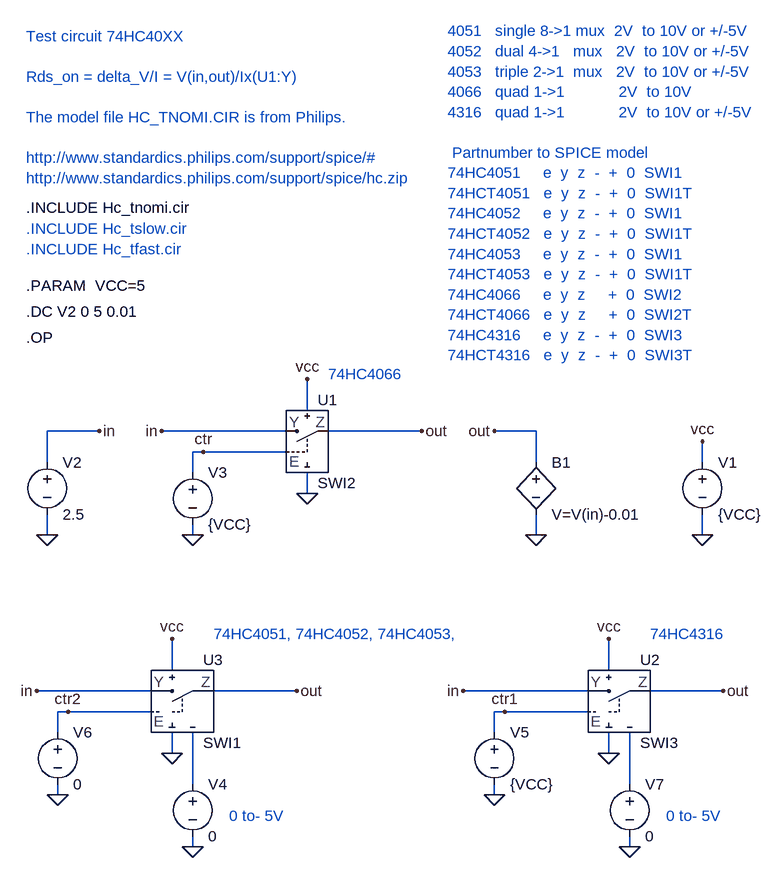
[diagram p0: schematic SWITCH_HC40XX_test.asc]
SWITCH_HC40XX_test.asc, the LTspice schematic file:
Version 4
SHEET 1 2080 1316
WIRE -272 160 -272 112
WIRE -272 272 -272 240
WIRE -256 576 -256 544
WIRE -256 672 -256 656
WIRE -240 544 -256 544
WIRE -192 112 -272 112
WIRE -112 512 -288 512
WIRE -112 544 -240 544
WIRE -80 480 -80 432
WIRE -80 608 -80 576
WIRE -48 176 -48 144
WIRE -48 272 -48 256
WIRE -48 656 -48 576
WIRE -48 752 -48 736
WIRE -32 144 -48 144
WIRE 96 112 -96 112
WIRE 96 144 -32 144
WIRE 112 512 -16 512
WIRE 128 80 128 32
WIRE 128 208 128 176
WIRE 304 112 160 112
WIRE 416 576 416 544
WIRE 416 672 416 656
WIRE 432 544 416 544
WIRE 480 112 416 112
WIRE 480 160 480 112
WIRE 480 272 480 240
WIRE 560 512 368 512
WIRE 560 544 432 544
WIRE 592 480 592 432
WIRE 592 608 592 576
WIRE 624 656 624 576
WIRE 624 752 624 736
WIRE 736 160 736 128
WIRE 736 272 736 240
WIRE 768 512 656 512
FLAG 736 272 0
FLAG -272 272 0
FLAG -48 272 0
FLAG 128 208 0
FLAG 480 272 0
FLAG -96 112 in
FLAG 304 112 out
FLAG 128 32 vcc
FLAG -32 144 ctr
FLAG -256 672 0
FLAG -80 608 0
FLAG -288 512 in
FLAG 112 512 out
FLAG -80 432 vcc
FLAG -240 544 ctr2
FLAG -48 752 0
FLAG 416 672 0
FLAG 368 512 in
FLAG 768 512 out
FLAG 592 432 vcc
FLAG 432 544 ctr1
FLAG 592 608 0
FLAG 624 752 0
FLAG -192 112 in
FLAG 416 112 out
FLAG 736 128 vcc
SYMBOL voltage 736 144 R0
SYMATTR InstName V1
SYMATTR Value {VCC}
SYMBOL voltage -272 144 R0
SYMATTR InstName V2
SYMATTR Value 2.5
SYMBOL voltage -48 160 R0
SYMATTR InstName V3
SYMATTR Value {VCC}
SYMBOL bv 480 144 R0
SYMATTR InstName B1
SYMATTR Value V=V(in)-0.01
SYMBOL voltage -256 560 R0
SYMATTR InstName V6
SYMATTR Value 0
SYMBOL XX4066 128 128 R0
SYMATTR SpiceModel SWI2
SYMATTR InstName U1
SYMBOL XX405X -64 528 R0
SYMATTR SpiceModel SWI1
SYMATTR InstName U3
SYMBOL voltage -48 640 R0
SYMATTR InstName V4
SYMATTR Value 0
SYMBOL voltage 416 560 R0
SYMATTR InstName V5
SYMATTR Value {VCC}
SYMBOL XX405X 608 528 R0
SYMATTR SpiceModel SWI3
SYMATTR InstName U2
SYMBOL voltage 624 640 R0
SYMATTR InstName V7
SYMATTR Value 0
TEXT -304 -232 Left 0 !.INCLUDE Hc_tnomi.cir
TEXT -304 -32 Left 0 !.OP
TEXT -304 -72 Left 0 !.DC V2 0 5 0.01
TEXT 160 24 Left 0 ;74HC4066
TEXT -16 424 Left 0 ;74HC4051, 74HC4052, 74HC4053,
TEXT 656 424 Left 0 ;74HC4316
TEXT 344 -504 Left 0 ;4051   single 8->1 mux  2V  to 10V or +/-5V\n4052   dual 4->1   mux   2V  to 10V or +/-5V\n4053   triple 2->1  mux   2V  to 10V or +/-5V\n4066   quad 1->1            2V  to 10V\n4316   quad 1->1            2V  to 10V or +/-5V\n \n Partnumber to SPICE model \n74HC4051     e  y  z  -  +  0  SWI1      \n74HCT4051   e  y  z  -  +  0  SWI1T  \n74HC4052     e  y  z  -  +  0  SWI1      \n74HCT4052   e  y  z  -  +  0  SWI1T\n74HC4053     e  y  z  -  +  0  SWI1      \n74HCT4053   e  y  z  -  +  0  SWI1T \n74HC4066     e  y  z     +  0  SWI2     \n74HCT4066   e  y  z     +  0  SWI2T\n74HC4316     e  y  z  -  +  0  SWI3      \n74HCT4316   e  y  z  -  +  0  SWI3T
TEXT 680 704 Left 0 ;0 to- 5V
TEXT 8 704 Left 0 ;0 to- 5V
TEXT -304 -496 Left 0 ;Test circuit 74HC40XX\n \nRds_on = delta_V/I = V(in,out)/Ix(U1:Y)\n \nThe model file HC_TNOMI.CIR is from Philips.\n \nhttp://www.standardics.philips.com/support/spice/#\nhttp://www.standardics.philips.com/support/spice/hc.zip
TEXT -304 -112 Left 0 !.PARAM  VCC=5
TEXT -304 -168 Left 0 ;.INCLUDE Hc_tfast.cir
TEXT -304 -200 Left 0 ;.INCLUDE Hc_tslow.cir

The netlist it stands for:
* SWITCH_HC40XX_test.asc
V1 vcc 0 {VCC}
V2 in 0 2.5
V3 ctr 0 {VCC}
B1 out 0 V=V(in)-0.01
V6 ctr2 0 0
XU1 ctr in out vcc 0 SWI2  ; pins EN Y OUT VCC VSS
XU3 ctr2 in out N001 vcc 0 SWI1  ; pins EN Y OUT VEE VCC VSS
V4 N001 0 0
V5 ctr1 0 {VCC}
XU2 ctr1 in out N002 vcc 0 SWI3  ; pins EN Y OUT VEE VCC VSS
V7 N002 0 0
.INCLUDE Hc_tnomi.cir
.OP
.DC V2 0 5 0.01
* 74HC4066
* 74HC4051, 74HC4052, 74HC4053,
* 74HC4316
* 4051   single 8->1 mux  2V  to 10V or +/-5V
* 4052   dual 4->1   mux   2V  to 10V or +/-5V
* 4053   triple 2->1  mux   2V  to 10V or +/-5V
* 4066   quad 1->1            2V  to 10V
* 4316   quad 1->1            2V  to 10V or +/-5V
*  Partnumber to SPICE model
* 74HC4051     e  y  z  -  +  0  SWI1
* 74HCT4051   e  y  z  -  +  0  SWI1T
* 74HC4052     e  y  z  -  +  0  SWI1
* 74HCT4052   e  y  z  -  +  0  SWI1T
* 74HC4053     e  y  z  -  +  0  SWI1
* 74HCT4053   e  y  z  -  +  0  SWI1T
* 74HC4066     e  y  z     +  0  SWI2
* 74HCT4066   e  y  z     +  0  SWI2T
* 74HC4316     e  y  z  -  +  0  SWI3
* 74HCT4316   e  y  z  -  +  0  SWI3T
* 0 to- 5V
* 0 to- 5V
* Test circuit 74HC40XX
* Rds_on = delta_V/I = V(in,out)/Ix(U1:Y)
* The model file HC_TNOMI.CIR is from Philips.
* http://www.standardics.philips.com/support/spice/#
* http://www.standardics.philips.com/support/spice/hc.zip
.PARAM  VCC=5
* .INCLUDE Hc_tfast.cir
* .INCLUDE Hc_tslow.cir
.backanno
.end